# EAGLE design Adafruit Feather STM32F405 Express (EAGLE 9.5.2)
COMPANY: ADAFRUIT INDUSTRIES; DRAWN: KTOWN; REV: B
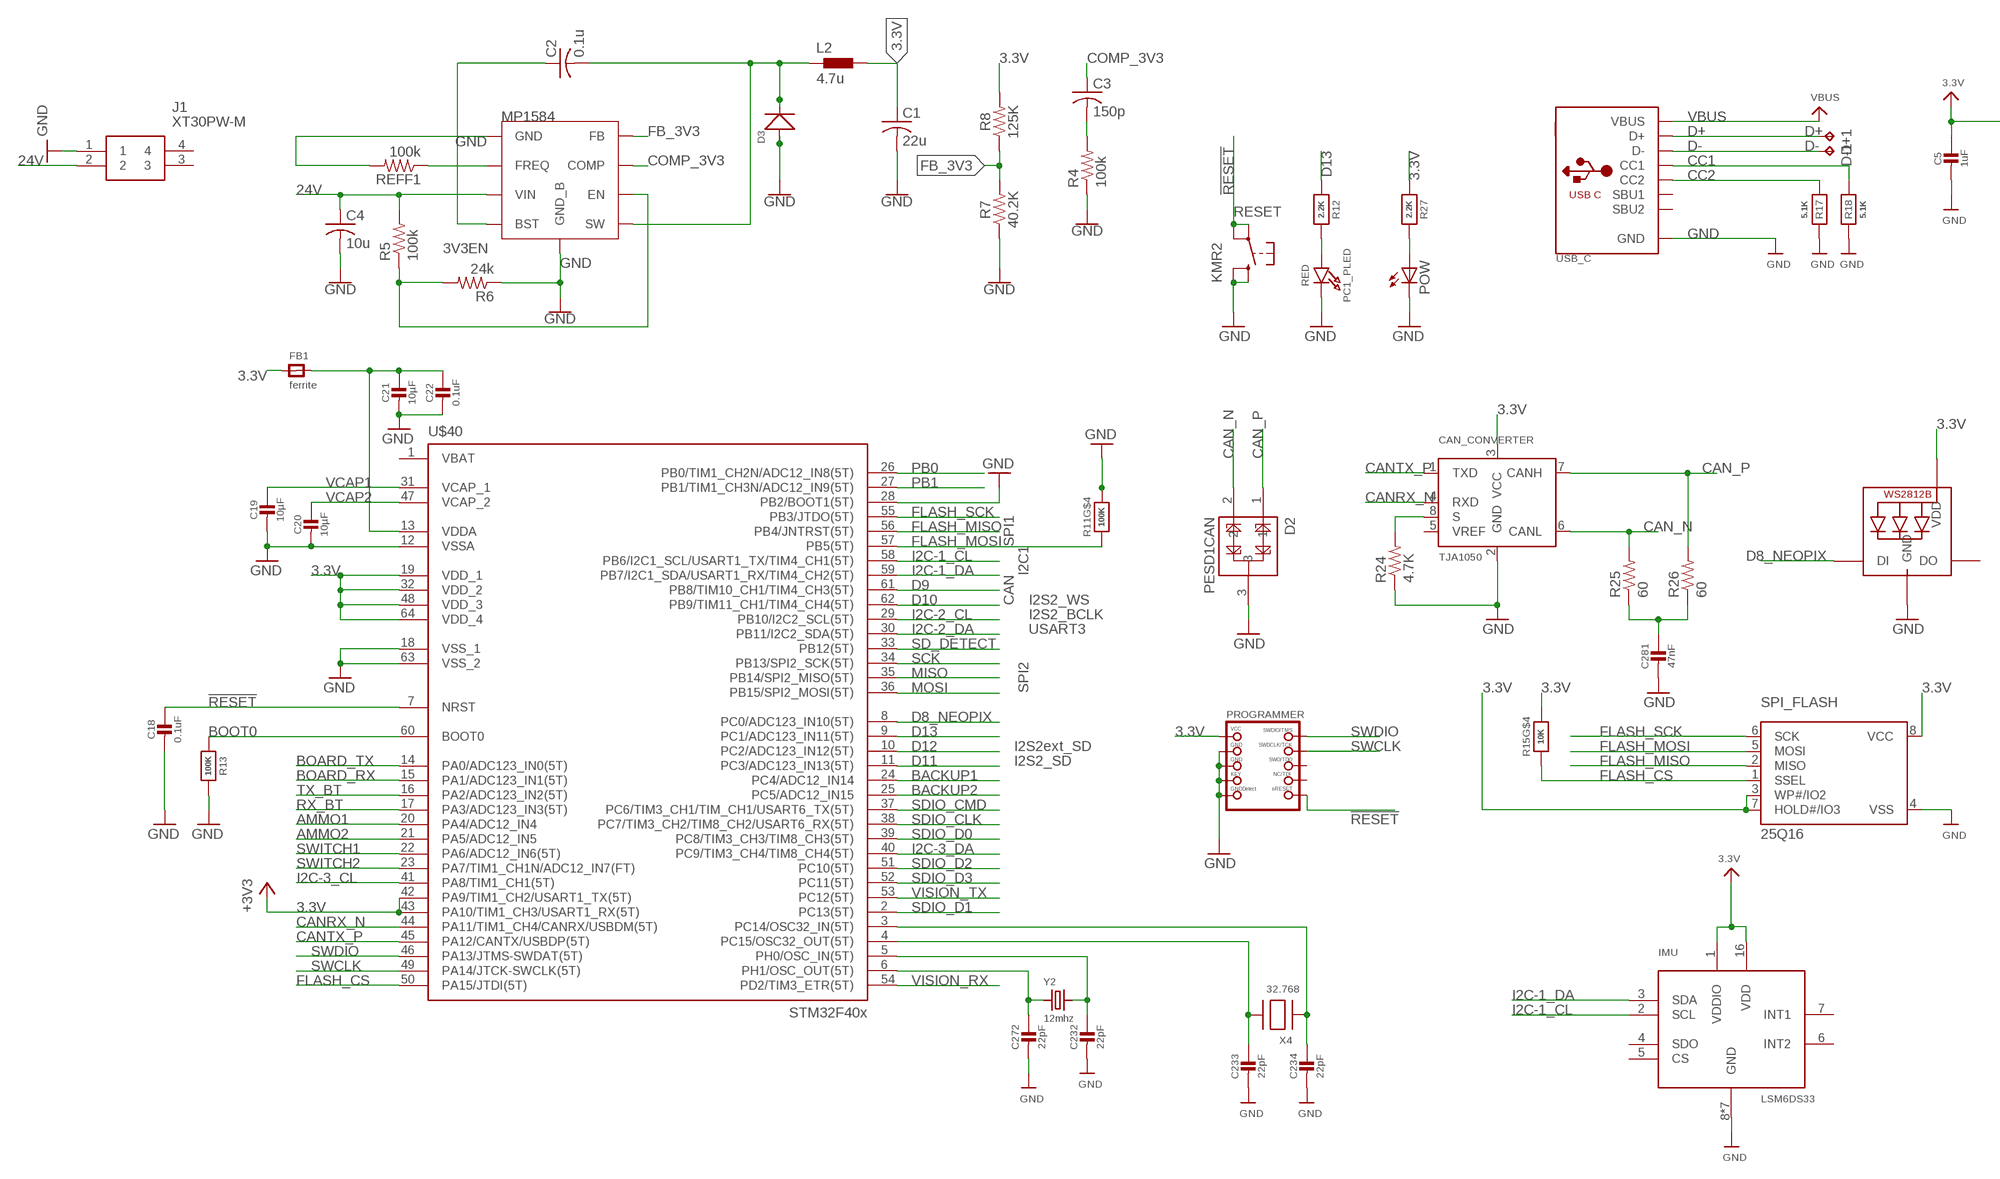
[diagram p0: schematic, sheet 1, part 1 of 2]
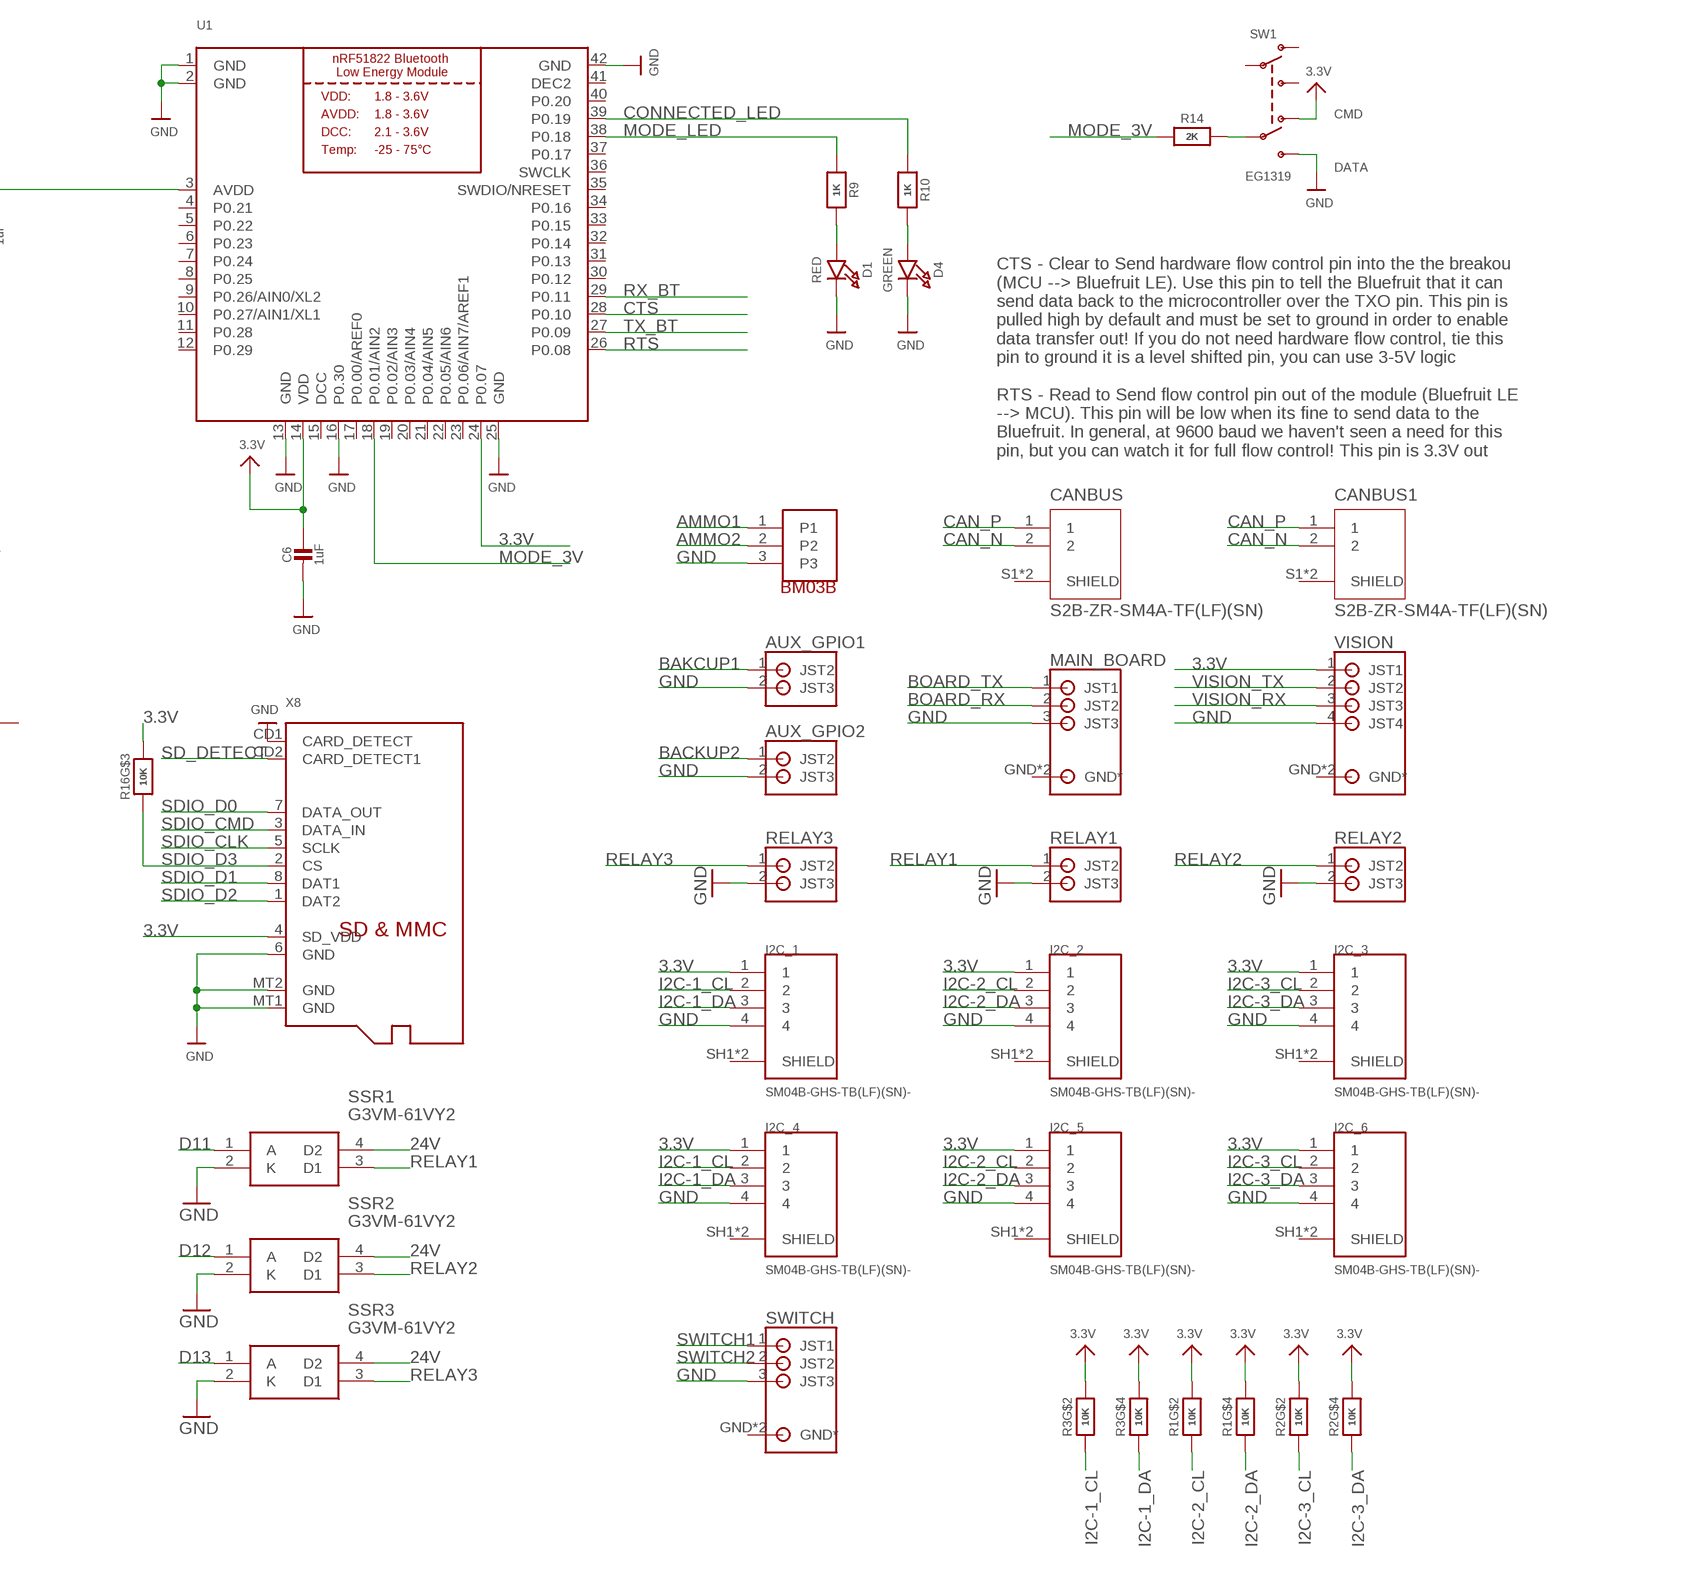
[diagram p1: schematic, sheet 1, part 2 of 2]

## Parts
AUX_GPIO1  S2B-PH-SM4_TB  [S2B-PH-SM4_TB]
AUX_GPIO2  S2B-PH-SM4_TB  [S2B-PH-SM4_TB]
C1  22u  C-USC1206  [C1206]
C2  0.1u  C-USC0603  [C0603]
C3  150p  C-USC0603  [C0603]
C4  10u  C-USC1206  [C1206]
C5  1uF  CAP_CERAMIC0805-NOOUTLINE  [0805-NO]
C6  1uF  CAP_CERAMIC0805-NOOUTLINE  [0805-NO]
C18  0.1uF  CAP_CERAMIC0603_NO  [0603-NO]
C19  10µF  CAP_CERAMIC0805-NOOUTLINE  [0805-NO]
C20  10µF  CAP_CERAMIC0805-NOOUTLINE  [0805-NO]
C21  10µF  CAP_CERAMIC0805-NOOUTLINE  [0805-NO]
C22  0.1uF  CAP_CERAMIC0603_NO  [0603-NO]
C23  22pF  CAP_4PACK1206  [RESPACK_4X0603]
C27  22pF  CAP_4PACK1206  [RESPACK_4X0603]
C28  47nF  CAP_4PACK1206  [RESPACK_4X0603]
CAN_CONVERTER  TJA1050  [SOT96-1]
CANBUS  S2B-ZR-SM4A-TF(LF)(SN)  [JST_S2B-ZR-SM4A-TF(LF)(SN)]
CANBUS1  S2B-ZR-SM4A-TF(LF)(SN)  [JST_S2B-ZR-SM4A-TF(LF)(SN)]
D1  RED  LED0805_NOOUTLINE  [CHIPLED_0805_NOOUTLINE]
D2  PESD1CAN  [SOT23-3]
D3  SMD-DIODE-SCHOTTKY-40V-3A(DO-214AB)  [DO-214AB]
D4  GREEN  LED0805_NOOUTLINE  [CHIPLED_0805_NOOUTLINE]
D+1  TPB1,27  [B1,27]
D-1  TPB1,27  [B1,27]
FB1  ferrite  FERRITE-0805NO  [0805-NO@1]
I2C_1  SM04B-GHS-TB(LF)(SN)-  [JST_SM04B-GHS-TB(LF)(SN)-]
I2C_2  SM04B-GHS-TB(LF)(SN)-  [JST_SM04B-GHS-TB(LF)(SN)-]
I2C_3  SM04B-GHS-TB(LF)(SN)-  [JST_SM04B-GHS-TB(LF)(SN)-]
I2C_4  SM04B-GHS-TB(LF)(SN)-  [JST_SM04B-GHS-TB(LF)(SN)-]
I2C_5  SM04B-GHS-TB(LF)(SN)-  [JST_SM04B-GHS-TB(LF)(SN)-]
I2C_6  SM04B-GHS-TB(LF)(SN)-  [JST_SM04B-GHS-TB(LF)(SN)-]
IMU  LSM6DS33  [LGA16_3X3MM]
J1  XT30PW-M  [XT30PWM]
L2  4.7u  MHCI0603-4R7M-R8  [MHCI0603-4R7M-R8]
LED2  WS2812B3535  [LED3535]
MAIN_BOARD  S3B-PH-SM4_TB  [S3B-PH-SM4_TB]
PC1_PLED  RED  LED0805_NOOUTLINE  [CHIPLED_0805_NOOUTLINE]
POW  LEDCHIPLED_0603  [CHIPLED_0603]
PROGRAMMER  JTAG-CORTEX  [2X05_1.27MM_SMT]
R1  10K  RESISTOR_4PACK  [RESPACK_4X0603]
R2  10K  RESISTOR_4PACK  [RESPACK_4X0603]
R3  10K  RESISTOR_4PACK  [RESPACK_4X0603]
R4  100k  R-US_R0603  [R0603]
R5  100k  R-US_R0603  [R0603]
R6  24k  R-US_R0603  [R0603]
R7  40.2K  220KOHM-0603-1/10W-1%  [0603]
R8  125K  RESISTOR0603  [0603]
R9  1K  RESISTOR0805_NOOUTLINE  [0805-NO]
R10  1K  RESISTOR0805_NOOUTLINE  [0805-NO]
R11  100K  RESISTOR_4PACK_NO  [RESPACK_4X0603_NO]
R12  2.2K  RESISTOR_0603_NOOUT  [0603-NO]
R13  100K  RESISTOR_0603_NOOUT  [0603-NO]
R14  2K  RESISTOR0805_NOOUTLINE  [0805-NO]
R15  10K  RESISTOR_4PACK_NO  [RESPACK_4X0603_NO]
R16  10K  RESISTOR_4PACK_NO  [RESPACK_4X0603_NO]
R17  5.1K  RESISTOR_0603_NOOUT  [0603-NO]
R18  5.1K  RESISTOR_0603_NOOUT  [0603-NO]
R24  4.7K  R-US_R0603  [R0603]
R25  60  R-US_R0603  [R0603]
R26  60  R-US_R0603  [R0603]
R27  2.2K  RESISTOR_0603_NOOUT  [0603-NO]
REFF1  100k  R-US_R0603  [R0603]
RELAY1  S2B-PH-SM4_TB  [S2B-PH-SM4_TB]
RELAY2  S2B-PH-SM4_TB  [S2B-PH-SM4_TB]
RELAY3  S2B-PH-SM4_TB  [S2B-PH-SM4_TB]
RESET  KMR2  SWITCH_TACT_SMT4.6X2.8  [BTN_KMR2_4.6X2.8]
SPI_FLASH  25Q16  SPIFLASH_8PIN  [SOIC8_150MIL]
SSR1  G3VM-61VY2  [SOP254P700X230-4N]
SSR2  G3VM-61VY2  [SOP254P700X230-4N]
SSR3  G3VM-61VY2  [SOP254P700X230-4N]
SW1  EG1319  SWITCH_DPDTEG1390  [EG1390]
SWITCH  S3B-PH-SM4_TB  [S3B-PH-SM4_TB]
U1  NRF51822_MODULE_MDBT40  [BLE_MODULE_RAYTAC_MDBT40]
U$6  BM03-GHS_TBT  [BM03-GHS-TBT]
U$10  MP1584_V2  [MP1584_V2]
U$40  STM32F405R  [TQFP64]
USB_C  USB_C  [USB_C_CUSB31-CFM2AX-01-X]
VISION  S4B-PH-SM4_TB  [S4B-PH-SM4_TB]
X4  32.768  XTAL-3.2X1.5  [XTAL3215]
X8  MICROSD  [MICROSD]
Y2  12mhz  CRYSTAL2.5X2.0  [CRYSTAL_2.5X2]

## Nets
3.3V: C1.1 C5.1 C6.1 CAN_CONVERTER.3(VCC) FB1.1 I2C_1.1 I2C_2.1 I2C_3.1 I2C_4.1 I2C_5.1 I2C_6.1 IMU.1(VDDIO) IMU.16(VDD) L2.P$2 LED2.2(VDD) PROGRAMMER.1(VCC) R1.2 R1.4 R2.2 R2.4 R3.2 R3.4 R8.2 R15.5 R16.6 R27.1 SPI_FLASH.3(WP#/IO2) SPI_FLASH.7(HOLD#/IO3) SPI_FLASH.8(VCC) SW1.O2 U1.3(AVDD) U1.14(VDD) U1.24(P0.07) U$40.19(VDD_1) U$40.32(VDD_2) U$40.42(PA9/TIM1_CH2/USART1_TX(5T)) U$40.43(PA10/TIM1_CH3/USART1_RX(5T)) U$40.48(VDD_3) U$40.64(VDD_4) VISION.1(JST1) X8.4(SD_VDD) ; supply symbol labelled +3V3
3V3EN: R5.1 R6.2 U$10.EN
24V [power]: C4.1 J1.2 R5.2 SSR1.4(D2) SSR2.4(D2) SSR3.4(D2) U$10.VIN
!RESET: C18.1 PROGRAMMER.10(NRESET) RESET.A'(P1) RESET.A(P) U$40.7(NRST)
AMMO1: U$6.1 U$40.20(PA4/ADC12_IN4)
AMMO2: U$6.2 U$40.21(PA5/ADC12_IN5)
BACKUP1: U$40.24(PC4/ADC12_IN14)
BACKUP2: AUX_GPIO2.1(JST2) U$40.25(PC5/ADC12_IN15)
BAKCUP1: AUX_GPIO1.1(JST2)
BOARD_RX: MAIN_BOARD.2(JST2) U$40.15(PA1/ADC123_IN1(5T))
BOARD_TX: MAIN_BOARD.1(JST1) U$40.14(PA0/ADC123_IN0(5T))
BOOT0: R13.1 U$40.60(BOOT0)
BST1: C2.1 U$10.BST
CAN_N: CAN_CONVERTER.6(CANL) CANBUS1.2 CANBUS.2 D2.2 R25.2
CAN_P: CAN_CONVERTER.7(CANH) CANBUS1.1 CANBUS.1 D2.1 R26.2
CANRX_N: CAN_CONVERTER.4(RXD) U$40.44(PA11/TIM1_CH4/CANRX/USBDM(5T))
CANTX_P: CAN_CONVERTER.1(TXD) U$40.45(PA12/CANTX/USBDP(5T))
CC1: R18.2 USB_C.A5(CC1)
CC2: R17.2 USB_C.B5(CC2)
COMP_3V3: C3.1 U$10.COMP
CONNECTED_LED: R10.1 U1.39(P0.19)
CTS: U1.28(P0.10)
D8_NEOPIX: LED2.1(DI) U$40.8(PC0/ADC123_IN10(5T))
D9: U$40.61(PB8/TIM10_CH1/TIM4_CH3(5T))
D10: U$40.62(PB9/TIM11_CH1/TIM4_CH4(5T))
D11: SSR1.1(A) U$40.11(PC3/ADC123_IN13(5T))
D12: SSR2.1(A) U$40.10(PC2/ADC123_IN12(5T))
D13: R12.1 SSR3.1(A) U$40.9(PC1/ADC123_IN11(5T))
D+: D+1.TP USB_C.A6(D+) USB_C.B6(D+)
D-: D-1.TP USB_C.A7(D-) USB_C.B7(D-)
FB_3V3: R7.2 R8.1 U$10.FB
FLASH_CS: R15.4 SPI_FLASH.1(SSEL) U$40.50(PA15/JTDI(5T))
FLASH_MISO: SPI_FLASH.2(MISO) U$40.56(PB4/JNTRST(5T))
FLASH_MOSI: R11.4 SPI_FLASH.5(MOSI) U$40.57(PB5(5T))
FLASH_SCK: SPI_FLASH.6(SCK) U$40.55(PB3/JTDO(5T))
FREQ1: REFF1.1 U$10.FREQ
GND [gnd]: AUX_GPIO1.2(JST3) AUX_GPIO2.2(JST3) C1.2 C4.2 C5.2 C6.2 C18.2 C19.2 C20.2 C21.2 C22.2 C23.5 C23.6 C23.7 C27.7 C28.8 CAN_CONVERTER.2(GND) D1.C D2.3 D3.1(+) D4.C I2C_1.4 I2C_2.4 I2C_3.4 I2C_4.4 I2C_5.4 I2C_6.4 IMU.8(GND) IMU.9(GND) IMU.10(GND) IMU.11(GND) IMU.12(GND) IMU.13(GND) IMU.15(GND) J1.1 LED2.4(GND) MAIN_BOARD.3(JST3) PC1_PLED.C POW.C PROGRAMMER.3(GND) PROGRAMMER.5(GND) PROGRAMMER.7(KEY) PROGRAMMER.9(GNDDETECT) R4.1 R6.1 R7.1 R11.5 R13.2 R17.1 R18.1 R24.1 REFF1.2 RELAY1.2(JST3) RELAY2.2(JST3) RELAY3.2(JST3) RESET.B'(S1) RESET.B(S) SPI_FLASH.4(VSS) SSR1.2(K) SSR2.2(K) SSR3.2(K) SW1.S2 SWITCH.3(JST3) U1.1(GND) U1.2(GND) U1.13(GND) U1.16(P0.30) U1.25(GND) U1.42(GND) U$6.3 U$10.GND U$10.GND_B U$40.12(VSSA) U$40.18(VSS_1) U$40.28(PB2/BOOT1(5T)) U$40.63(VSS_2) USB_C.A1B12(GND) USB_C.B1A12(GND) VISION.4(JST4) X8.6(GND) X8.CD1(CARD_DETECT) X8.MT1(GND) X8.MT2(GND)
I2C-1_CL: I2C_1.2 I2C_4.2 IMU.2(SCL) R3.7 U$40.58(PB6/I2C1_SCL/USART1_TX/TIM4_CH1(5T))
I2C-1_DA: I2C_1.3 I2C_4.3 IMU.3(SDA) R3.5 U$40.59(PB7/I2C1_SDA/USART1_RX/TIM4_CH2(5T))
I2C-2_CL: I2C_2.2 I2C_5.2 R1.7 U$40.29(PB10/I2C2_SCL(5T))
I2C-2_DA: I2C_2.3 I2C_5.3 R1.5 U$40.30(PB11/I2C2_SDA(5T))
I2C-3_CL: I2C_3.2 I2C_6.2 R2.7 U$40.41(PA8/TIM1_CH1(5T))
I2C-3_DA: I2C_3.3 I2C_6.3 R2.5 U$40.40(PC9/TIM3_CH4/TIM8_CH4(5T))
MISO: U$40.35(PB14/SPI2_MISO(5T))
MODE_3V: R14.1 U1.18(P0.01/AIN2)
MODE_LED: R9.1 U1.38(P0.18)
MOSI: U$40.36(PB15/SPI2_MOSI(5T))
N$3: C3.2 R4.2
N$4: R14.2 SW1.P2
N$5: D1.A R9.2
N$6: D4.A R10.2
N$9: C23.4 U$40.3(PC14/OSC32_IN(5T)) X4.P$1
N$10: C23.3 U$40.4(PC15/OSC32_OUT(5T)) X4.P$2
N$11: C23.2 U$40.5(PH0/OSC_IN(5T)) Y2.3
N$12: C27.2 U$40.6(PH1/OSC_OUT(5T)) Y2.1
N$13: PC1_PLED.A R12.2
N$20: C21.1 C22.1 FB1.2 U$40.13(VDDA)
N$21: CAN_CONVERTER.8(S) R24.2
N$22: C28.1 R25.1 R26.1
N$23: POW.A R27.2
PB0: U$40.26(PB0/TIM1_CH2N/ADC12_IN8(5T))
PB1: U$40.27(PB1/TIM1_CH3N/ADC12_IN9(5T))
RELAY1: RELAY1.1(JST2) SSR1.3(D1)
RELAY2: RELAY2.1(JST2) SSR2.3(D1)
RELAY3: RELAY3.1(JST2) SSR3.3(D1)
RTS: U1.26(P0.08)
RX_BT: U1.29(P0.11) U$40.17(PA3/ADC123_IN3(5T))
SCK: U$40.34(PB13/SPI2_SCK(5T))
SD_DETECT: U$40.33(PB12(5T)) X8.CD2(CARD_DETECT1)
SDIO_CLK: U$40.38(PC7/TIM3_CH2/TIM8_CH2/USART6_RX(5T)) X8.5(SCLK)
SDIO_CMD: U$40.37(PC6/TIM3_CH1/TIM_CH1/USART6_TX(5T)) X8.3(DATA_IN)
SDIO_D0: U$40.39(PC8/TIM3_CH3/TIM8_CH3(5T)) X8.7(DATA_OUT)
SDIO_D1: U$40.2(PC13(5T)) X8.8(DAT1)
SDIO_D2: U$40.51(PC10(5T)) X8.1(DAT2)
SDIO_D3: R16.3 U$40.52(PC11(5T)) X8.2(CS)
SW1: C2.2 D3.2(-) L2.P$1 U$10.SW
SWCLK: PROGRAMMER.4(SWDCLK) U$40.49(PA14/JTCK-SWCLK(5T))
SWDIO: PROGRAMMER.2(SWDIO) U$40.46(PA13/JTMS-SWDAT(5T))
SWITCH1: SWITCH.1(JST1) U$40.22(PA6/ADC12_IN6(5T))
SWITCH2: SWITCH.2(JST2) U$40.23(PA7/TIM1_CH1N/ADC12_IN7(FT))
TX_BT: U1.27(P0.09) U$40.16(PA2/ADC123_IN2(5T))
VBUS [power]: USB_C.A4B9(VBUS) USB_C.B4A9(VBUS)
VCAP1: C19.1 U$40.31(VCAP_1)
VCAP2: C20.1 U$40.47(VCAP_2)
VISION_RX: U$40.54(PD2/TIM3_ETR(5T)) VISION.3(JST3)
VISION_TX: U$40.53(PC12(5T)) VISION.2(JST2)
Unconnected: C23.1 C23.8 C27.1 C27.3 C27.4 C27.5 C27.6 C27.8 C28.2 C28.3 C28.4 C28.5 C28.6 C28.7 CAN_CONVERTER.5(VREF) CANBUS1.S1(SHIELD) CANBUS1.S2(SHIELD) CANBUS.S1(SHIELD) CANBUS.S2(SHIELD) IMU.4(SDO) IMU.5(CS) IMU.6(INT2) IMU.7(INT1) J1.3 J1.4 LED2.3(DO) MAIN_BOARD.GND2(GND*) MAIN_BOARD.GND(GND*) PROGRAMMER.6(SWO) PROGRAMMER.8(TDI) R1.1 R1.3 R1.6 R1.8 R2.1 R2.3 R2.6 R2.8 R3.1 R3.3 R3.6 R3.8 R11.1 R11.2 R11.3 R11.6 R11.7 R11.8 R15.1 R15.2 R15.3 R15.6 R15.7 R15.8 R16.1 R16.2 R16.4 R16.5 R16.7 R16.8 SW1.O1 SW1.P1 SW1.S1 SWITCH.GND2(GND*) SWITCH.GND(GND*) U1.4(P0.21) U1.5(P0.22) U1.6(P0.23) U1.7(P0.24) U1.8(P0.25) U1.9(P0.26/AIN0/XL2) U1.10(P0.27/AIN1/XL1) U1.11(P0.28) U1.12(P0.29) U1.17(P0.00/AREF0) U1.19(P0.02/AIN3) U1.20(P0.03/AIN4) U1.21(P0.04/AIN5) U1.22(P0.05/AIN6) U1.23(P0.06/AIN7/AREF1) U1.30(P0.12) U1.31(P0.13) U1.32(P0.14) U1.33(P0.15) U1.34(P0.16) U1.35(SWDIO/NRESET) U1.36(SWCLK) U1.37(P0.17) U1.40(P0.20) U$40.1(VBAT) USB_C.A8(SBU1) USB_C.B8(SBU2) VISION.GND2(GND*) VISION.GND(GND*)

## Notes on the sheet
- CMD
- DATA
- CTS - Clear to Send hardware flow control pin into the the breakou 
  (MCU --> Bluefruit LE). Use this pin to tell the Bluefruit that it can 
  send data back to the microcontroller over the TXO pin. This pin is 
  pulled high by default and must be set to ground in order to enable 
  data transfer out! If you do not need hardware flow control, tie this 
  pin to ground it is a level shifted pin, you can use 3-5V logic
  
  RTS - Read to Send flow control pin out of the module (Bluefruit LE 
  --> MCU). This pin will be low when its fine to send data to the 
  Bluefruit. In general, at 9600 baud we haven't seen a need for this 
  pin, but you can watch it for full flow control! This pin is 3.3V out
- SPI1
- I2C1
- CAN | I2S2_WS
- I2S2_BCLK
- USART3
- SPI2
- I2S2ext_SD
- I2S2_SD

## Power pins joined to a net without a drawn wire
DCC: U1.15(DCC)
DEC2: U1.41(DEC2)
SHIELD: I2C_1.SH1(SHIELD) I2C_1.SH2(SHIELD) I2C_2.SH1(SHIELD) I2C_2.SH2(SHIELD) I2C_3.SH1(SHIELD) I2C_3.SH2(SHIELD) I2C_4.SH1(SHIELD) I2C_4.SH2(SHIELD) I2C_5.SH1(SHIELD) I2C_5.SH2(SHIELD) I2C_6.SH1(SHIELD) I2C_6.SH2(SHIELD)

## Library data of the parts
AUX_GPIO1 AUX_GPIO2 RELAY1-RELAY3 = KevinMade:S2B-PH-SM4_TB
C1-C4 = adafruit:C-US: CAPACITOR, American symbol
C5 C6 C18-C22 = microbuilder:CAP_CERAMIC: Ceramic Capacitors For new designs, use the packages preceded by an '_' character since they are more reliable: The following footprints should be used on most boards: _0402 - Standard footprint for regular board layouts _0603 - Standard footprint for regular board layouts _0805 - Standard footprint for regular board layouts _1206 - Standard footprint for regular board layouts For extremely tight-pitch boards where space is at a premium, the following 'micro-pitch' footprints can be used (smaller pads, no silkscreen outline, etc.): _0402MP - Micro-pitch footprint for very dense/compact boards _0603MP - Micro-pitch footprint for very dense/compact boards _0805MP - Micro-pitch footprint for very dense/compact boards _1206MP - Micro-pitch footprint for very dense/compact boards
C23 C27 C28 = microbuilder:CAP_4PACK
CAN_CONVERTER = TJA1050:TJA1050: High speed CAN transceiver The TJA1050 is the interface between the Controller Area Network (CAN) protocol controller and the physical bus. The device provides differential transmit capability to the bus and differential receive capability to the CAN controller. The TJA1050 is the third Philips high-speed CAN transceiver after the PCA82C250 and the PCA82C251. The most important differences are: Much lower electromagnetic emission due to optimal matching of the output signals CANH and CANL Improved behaviour in case of an unpowered node No standby mode. This makes the TJA1050 eminently suitable for use in nodes that are in a power-down situation in partially powered networks. AAL Eindhoven MK; AVAILABILITY: Unavailable; DESCRIPTION: 1/1 Transceiver Half CANbus 8-SO; MF: NXP USA; MP: TJA1050; PACKAGE: SOIC-8 NXP USA; PRICE: None
CANBUS CANBUS1 = S2B-ZR-SM4A-TF_LF__SN_:S2B-ZR-SM4A-TF(LF)(SN): ZH Series 2 Position 1.5 mm Pitch Surface Mount Side Entry Shrouded Header; AVAILABILITY: Unavailable; DESCRIPTION: Connector Header Surface Mount, Right Angle 2 position 0.059 _1.50mm_; MF: JST Sales; MP: S2B-ZR-SM4A-TF_LF__SN_; PACKAGE: None; PRICE: None
D1 D4 PC1_PLED = microbuilder:LED: LED
D2 = PESD1CAN:PESD1CAN: PESD1CAN is used to protect two automotive CAN bus lines from ESD.; AVAILABILITY: Unavailable; DESCRIPTION: 50V Clamp 3A _8/20µs_ Ipp Tvs Diode Surface Mount SC-70; MF: NXP Semiconductors; MP: PESD1CAN; PACKAGE: SC-70 NXP Semiconductors; PRICE: None
D3 = SMD-DIODE-SCHOTTKY-40V-3A_DO-214AB_:SMD-DIODE-SCHOTTKY-40V-3A(DO-214AB): 304020018; AVAILABILITY: Unavailable; DESCRIPTION: Rectifier, Schottky; DO-214AB; 3.0A IF; 0.75V; 40V; 100A IFRM; 10000V/us; 1000pF; MF: Vishay; MP: SS34-E3/57T; PACKAGE: DO-214 Vishay; PRICE: None
D+1 D-1 = testpad:TP: Test pad
FB1 = microbuilder:FERRITE: Ferrite Bead 0603 MMZ1608B121C - 120 Ohm @ 100MHz, 600mA, 0.15 Ohm DC Resistance - Digikey: 445-2164-1-ND BK1608HW121-T - 120 Ohm, 600mA Ferrite Chip - Digikey: 587-1876-2-ND 0805 HZ0805B272R-10 - 2.7K Ohm @ 100MHz, 200mA, 0.8 Ohm DC Resistance - Digikey: 240-2504-1-ND (see also Murata BLM21BD272SN1L) MMZ2012Y152B - 1.5K Ohm @ 100MHz, 500mA, 0.4 Ohm DC Resistance - Digikey: 445-1560-1-ND - Mainly for high frequency (80-400MHz) MMZ2012R102A - 1K Ohm @ 100MHz, 500mA, 0.3 Ohm DC Resistance - Digikey: 445-1555-2-ND - More general purpose (10-200MHz)
I2C_1-I2C_6 = SM04B-GHS-TB_LF__SN_-:SM04B-GHS-TB(LF)(SN)-: Conn Header Gh Side 4pos 1.25mm; AVAILABILITY: Unavailable; DESCRIPTION: Connector Header Surface Mount, Right Angle 4 position 0.049 _1.25mm_; MF: JST Sales; MP: SM04B-GHS-TB_LF__SN_-; PACKAGE: None; PRICE: None
IMU = adafruit_sensor:LSM6DS33
J1 = SamacSys_Parts:XT30PW-M: 30A Low Temperature Rise Fire Retardant Plug Source: Datasheet <https://www.tme.eu/sl/Document/ce4077e36b79046da520ca73227e15de/XT30PW SPEC.pdf>; DESCRIPTION: 30A Low Temperature Rise Fire Retardant Plug; HEIGHT: 5mm; MANUFACTURER_NAME: Amass; MANUFACTURER_PART_NUMBER: XT30PW-M
L2 = NewKevinMade:MHCI0603-4R7M-R8
LED2 = microbuilder:WS2812B
MAIN_BOARD SWITCH = KevinMade:S3B-PH-SM4_TB
POW = adafruit:LED: LED
PROGRAMMER = microbuilder:JTAG-CORTEX: Serial Wire (SW-DP) Connector Standard 0.05" 10-pin connector is for use with the Cortex M and Cortex A SWD (serial wire debugger) interface (SW-DP) Connectors 2x05_1.27MM_SMT - Inexpensive surface-mount header with bare pins, compatible with standard 10-pin SWD cables (4UCON: 16846) 2x05_1.27MM_BOX_NOPOSTS - Polarised surface-mount box (4UCON with caps: 19735, without caps: 15117 2x05_1.27MM_BOX_POSTS - Polarised surface-mount box with mounting holes (4UCON: 20317) Pinout: http://infocenter.arm.com/help/topic/com.arm.doc.faqs/attached/13634/cortex_debug_connectors.pdf http://www.keil.com/peripherals/coresight/connectors.asp
R1-R3 R11 R15 R16 = microbuilder:RESISTOR_4PACK: Resistor Packs (4 resistors) 4 x 0603 10K 1/16W - Digikey: YC164J-10KCT-ND
R4-R6 R24-R26 REFF1 = adafruit:R-US_: RESISTOR, American symbol
R7 = SparkFun-Resistors:220KOHM: 220kΩ resistor A resistor is a passive two-terminal electrical component that implements electrical resistance as a circuit element. Resistors act to reduce current flow, and, at the same time, act to lower voltage levels within circuits. - Wikipedia; PROD_ID: RES-08969; VALUE: 220k
R8 = SparkFun-Resistors:RESISTOR: Generic Resistor Package
R9 R10 R12-R14 R17 R18 R27 = microbuilder:RESISTOR: Resistors For new designs, use the packages preceded by an '_' character since they are more reliable: The following footprints should be used on most boards: _0402 - Standard footprint for regular board layouts _0603 - Standard footprint for regular board layouts _0805 - Standard footprint for regular board layouts _1206 - Standard footprint for regular board layouts For extremely tight-pitch boards where space is at a premium, the following 'micro-pitch' footprints can be used (smaller pads, no silkscreen outline, etc.): _0402MP - Micro-pitch footprint for very dense/compact boards _0603MP - Micro-pitch footprint for very dense/compact boards _0805MP - Micro-pitch footprint for very dense/compact boards _1206MP - Micro-pitch footprint for very dense/compact boards
RESET = microbuilder:SWITCH_TACT_SMT: SMT Tact Switches 6x6mm - Digikey: P12940SCT-ND KMR2 (4.6x2.8mm) - Digikey: 401-1426-1-ND EVQ-PQHB55 - Light Touch, 160GF (4.5x4.5mm) - Digikey: P8090SCT-ND KMT0 - KMT021 NGJ LHS (etc.) IP68/Waterproof - Digikey: CKN10289CT-ND
SPI_FLASH = microbuilder:SPIFLASH_8PIN: SOIC8 SPI Flash Be careful with the size since SOIC8 flash comes in several 'widths' SOIC8 150 mil M25P16 - 16Mbit (2Mbit x 8) Serial Flash (75MHz SPI Bus), Supply: 2.7-3.6V Digikey: SOIC8 - M25P16-VMN6P-ND SOIC8 208 mil W25Q16BVSSIG - 16Mbit (2Mbit x 8) Serial Flash (104MHz SPI Bus), Supply: 2.7-3.6V Digikey: SOIC8 - W25Q16BVSSIG-ND
SSR1-SSR3 = SamacSys_Parts:G3VM-61VY2: Solid State Relays - PCB Mount Mos Fet Relay, SMT 60V, 1 form A,SOP4 Source: Datasheet <https://componentsearchengine.com/Datasheets/1/G3VM-61VY2.pdf>; DESCRIPTION: Solid State Relays - PCB Mount Mos Fet Relay, SMT 60V, 1 form A,SOP4; HEIGHT: 2.3mm; MANUFACTURER_NAME: Omron Electronics; MANUFACTURER_PART_NUMBER: G3VM-61VY2; MOUSER_PART_NUMBER: 653-G3VM61VY2; MOUSER_PRICE-STOCK: https://www.mouser.com/Search/Refine.aspx?Keyword=653-G3VM61VY2
SW1 = microbuilder:SWITCH_DPDT: Switch - DPDT A DPDT Switch acts like an SPDT switch, but has a pair of switches instead of just one. Vertical - 0.3A @ 6V SMT - Digikey: JS202011SCQN
U1 = microbuilder:NRF51822_MODULE_MDBT40: nRF51822 Bluetooth Low Energy Module
U$6 = SamacSys_Parts:BM03-GHS_TBT
U$10 = mp1584S:MP1584_V2
U$40 = adafruit_micro:STM32F405R: STM32F405 64 pin LQFP reviewed: YES tested: YES
USB_C = microbuilder:USB_C: USB Type-C USB 2.0 Connector
VISION = KevinMade:S4B-PH-SM4_TB
X4 = adafruit2:XTAL: Low cost SMT crystals, no capacitors included http://www.ladyada.net/library/eagle
X8 = microbuilder:MICROSD: MicroSD/Transflash Card Holder with SPI pinout 3M: 2908-05WB-MG 4UConnector: 19656 Footprint courtesy: Adafruit Industries
Y2 = microbuilder:CRYSTAL: Crystals HC49UP - Surface Mount Crystal 4.0MHz 18pF +/-30ppm Surface Mount Crystal [Digikey: 535-9857-1-ND] 12.0 MHz Surface Mount Crystal [Digikey: 535-9869-6-ND] 25.0 MHz Surface Mount Crystal [Digikey: 535-9078-1-ND] 2.5 x 2.0mm - MEMs SMT Crystal 16.0 MHz 10pF 20ppm 2.5 x 2.0mm Crystal [Digikey -40-85°C: 535-10923-1-ND] 3.2 x 2.5mm - MEMs SMT Crystal 12.0 MHz 8pF 15ppm 3.2 x 2.5mm Crystal [Digikey: -10-70°C: 644-1047-1-ND -40-125°C: 644-1128-1-ND] 40~85°C cheaper: 644-1173-6-ND 16.0 MHz 8pF 15ppm 3.2 x 2.5mm Crystal [Digikey: -10-70°C: 644-1049-1-ND -40-125°C: 644-1129-2-ND]-40~85°C cheaper: 644-1175-6-ND 16.0 MHz 10pF 10ppm 3.2 x 2.5mm Crystal [Digikey: 644-1100-1-ND] 27.12 MHz 18pF 30ppm 3.2 x 2.5mm Crystal [Digikey: 887-1424-1-ND] 27.12MHz 10pF 10ppm 3.2 x 2.5mm Crystal [Digikey: 887-1329-1-ND] 4.9 x 1.8mm - MEMs SMT Crystal 32.768 KHz 12.5pF 20ppm 4.9 x 1.8mm Crystal [Digikey: SE2415CT-ND] 8.0 x 3.8mm - Surface Mount Crystal 32.768kHz 12.5pF 20ppm -40°C-85°C [Digikey: 535-9166-2-ND] Cylinder 32.768KHz Cylinder Crystal (2x6mm body) [Ex. Digikey: 300-8341-2-ND]

## Net classes
1 power: width 0.305 mm
2 gnd: width 0.254 mm
3 can: width 0.203 mm
4 canx: width 0.203 mm

## Board
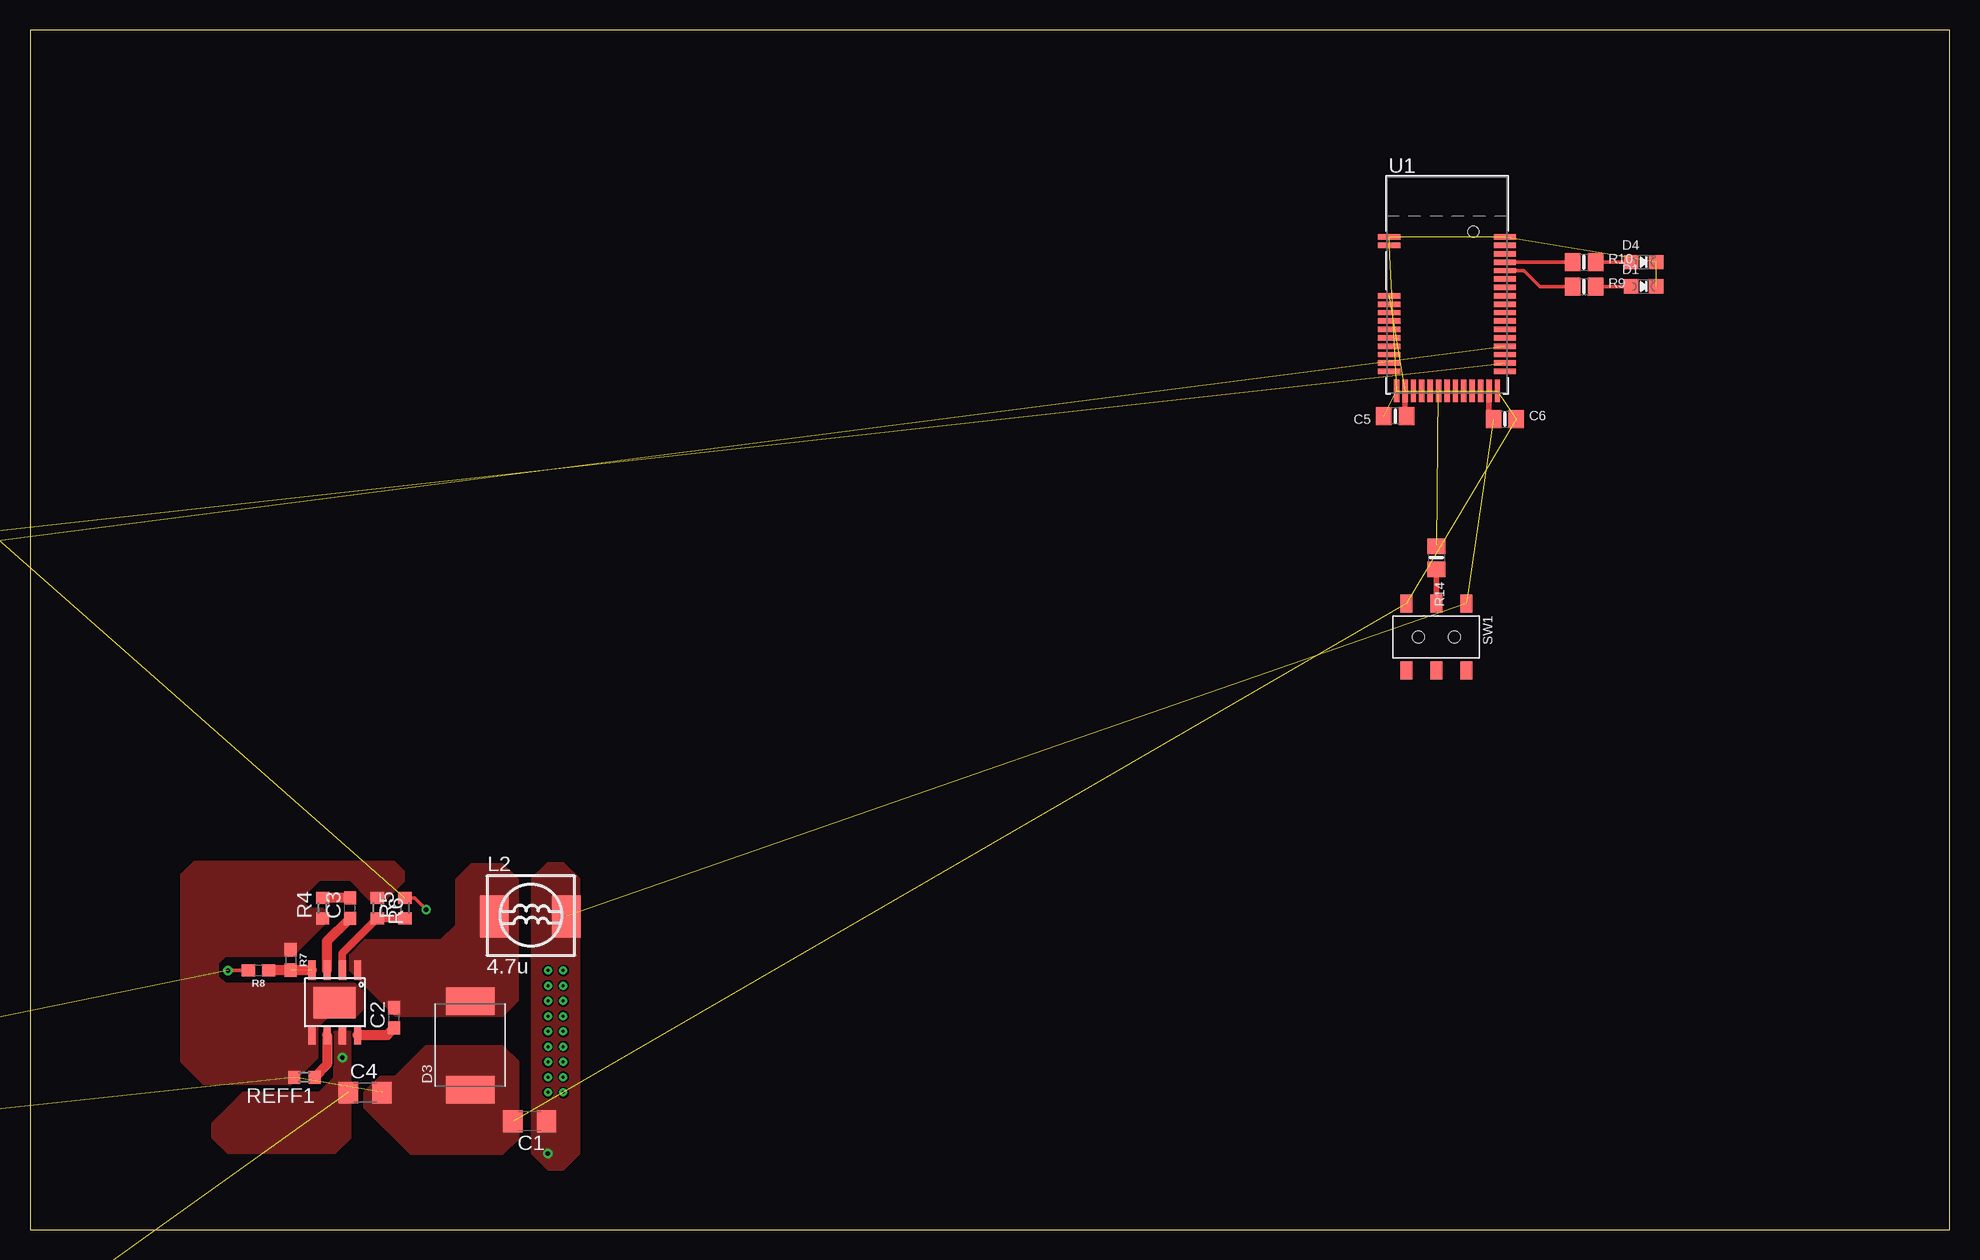
[diagram p2: board, top side]
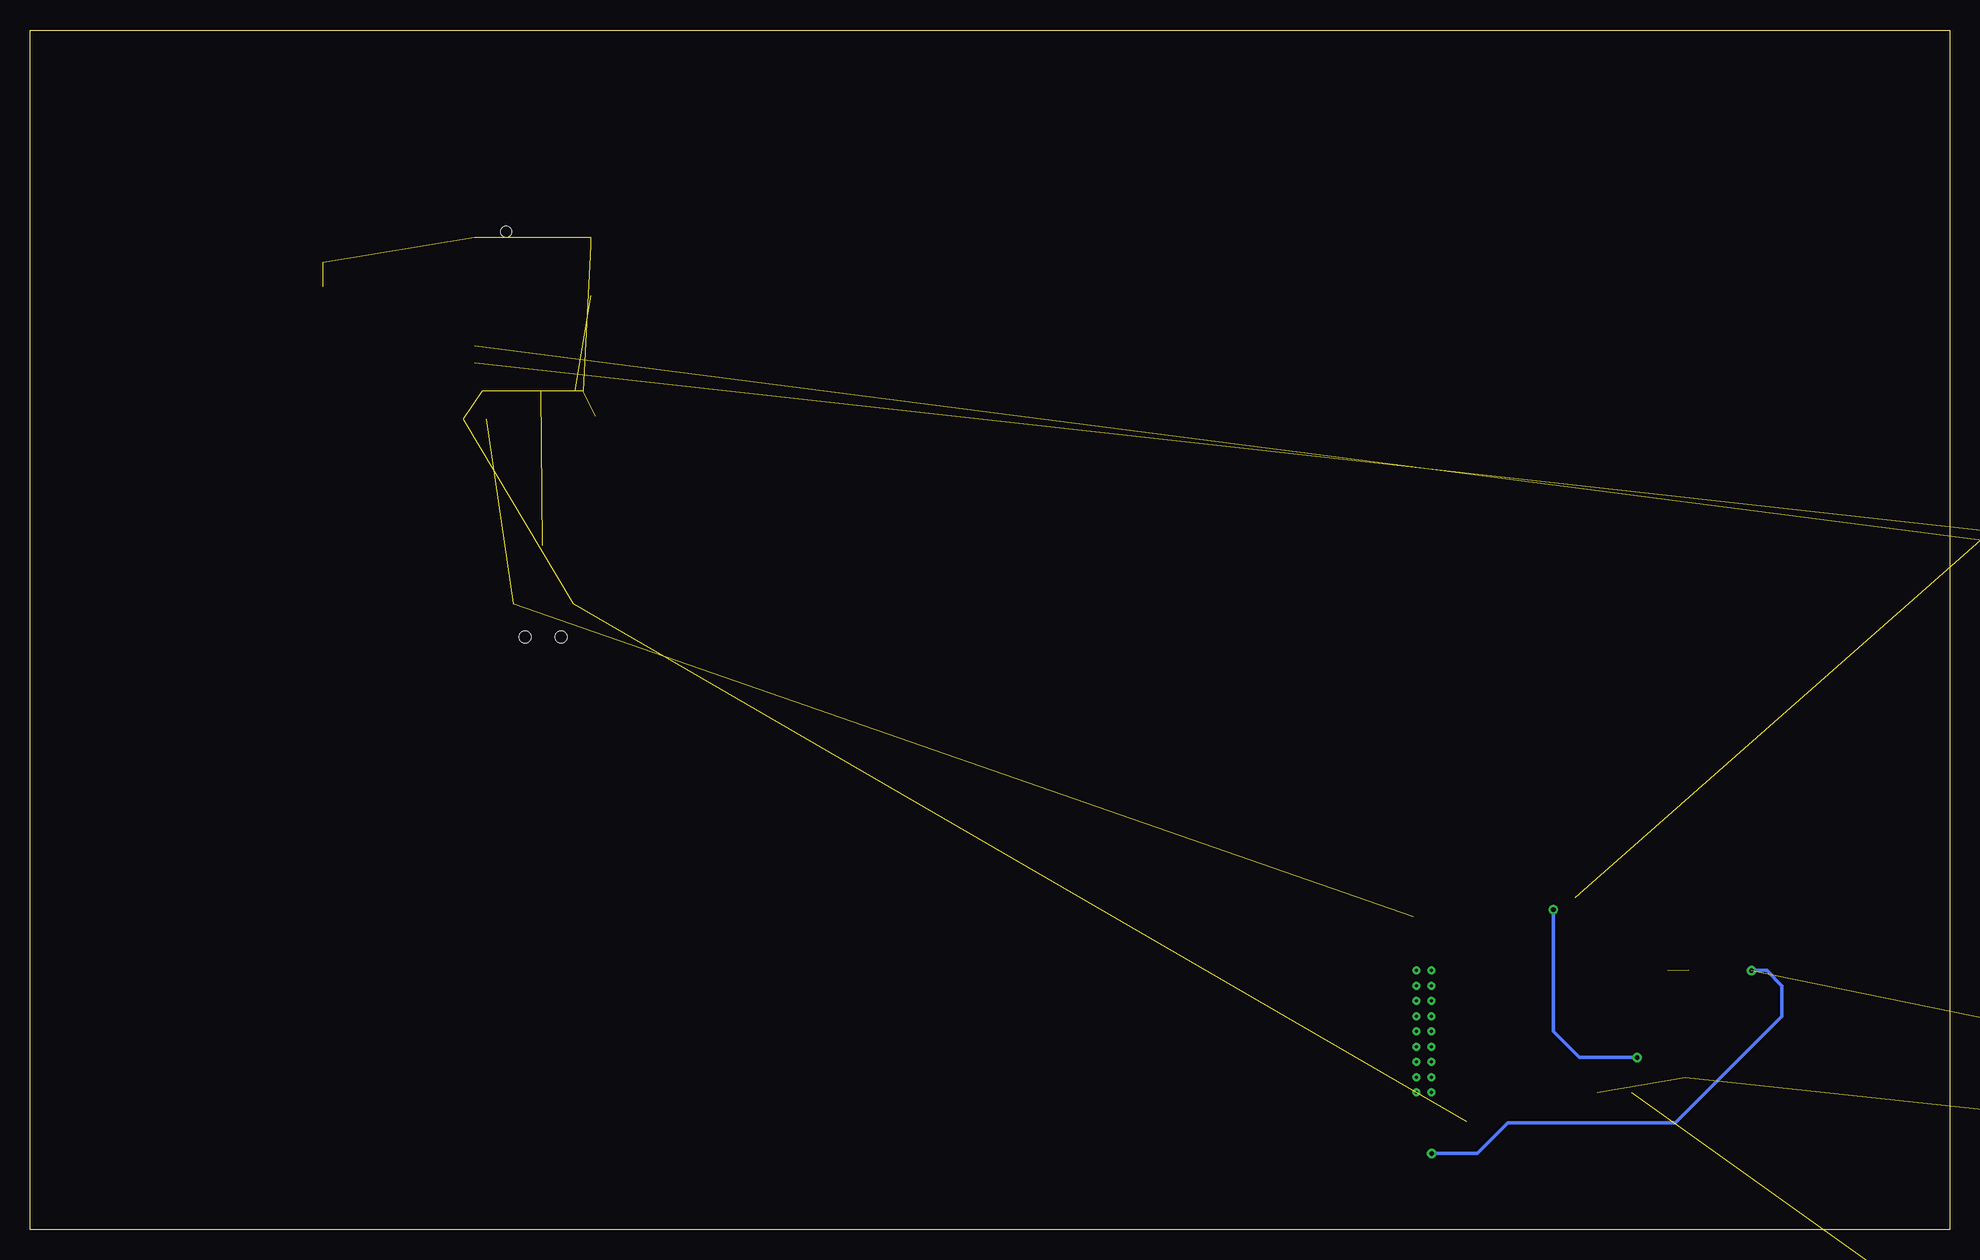
[diagram p3: board, bottom side, seen from below]

Size 160 x 100 mm. Coordinates in mm from the lower left corner, seen from the top.
Outline: 0,0 160,0 160,100 0,100 0,0
Copper layers (1*16): Top 0.035mm / dielectric 1.5mm / Bottom 0.035mm
Design rules "default": minimum track width 6mil, minimum drill 0.35mm, track to track 6mil, track to pad 6mil, pad to pad 6mil, via to via 6mil, smd to smd 6mil, copper to edge 40mil, drill to drill 6mil, minimum pad ring 10mil, minimum via ring 8mil, stop-mask expansion 4mil, vias tented up to drill 0mil, thermal gap 10mil

### Footprints (pad centres in the part's own frame; a part is rotated, then mirrored left to right if it is on the bottom)
S2B-PH-SM4_TB = smd 1 x 2.6: 1 3.81,8.28; 2 5.81,8.28 | smd 1 x 3: GND 0.826,2.48; GND2 8.787,2.48
C1206 = smd 1.6 x 1.8: 1 -1.4,0; 2 1.4,0
C0603 = smd 1.1 x 1: 1 -0.85,0; 2 0.85,0
0805-NO = smd 1.3 x 1.5: 1 -0.95,0; 2 0.95,0
0603-NO = smd 1.1 x 1: 1 -0.85,0; 2 0.85,0
RESPACK_4X0603 = smd 0.45 x 0.9: 1 -1.3,-0.85; 2 -0.4,-0.85; 3 0.4,-0.85; 4 1.3,-0.85; 5 1.3,0.85; 6 0.4,0.85; 7 -0.4,0.85; 8 -1.3,0.85
SOT96-1 = smd 0.6 x 1.3: 1 -1.905,-2.65; 2 -0.635,-2.65; 3 0.635,-2.65; 4 1.905,-2.65; 5 1.905,2.65; 6 0.635,2.65; 7 -0.635,2.65; 8 -1.905,2.65
JST_S2B-ZR-SM4A-TF(LF)(SN) = smd 0.7 x 2.5: 1 -0.75,2.15; 2 0.75,2.15 | smd 1.1 x 1.9: S1 -2.7,-1.45; S2 2.7,-1.45
CHIPLED_0805_NOOUTLINE = smd 1.2 x 1.2: A 0,-1.05; C 0,1.05
SOT23-3 = smd 0.8 x 0.9: 1 -0.95,-1; 2 0.95,-1; 3 0,1.1
DO-214AB = smd 2.286 x 4.064: 1 -3.683,0; 2 3.683,0
B1,27 = smd 1.27 x 1.27: TP 0,0
0805-NO@1 = smd 1.24 x 1.5: 1 -0.95,0; 2 0.95,0
JST_SM04B-GHS-TB(LF)(SN)- = smd 0.6 x 1.7: 1 -1.875,2.275; 2 -0.625,2.275; 3 0.625,2.275; 4 1.875,2.275 | smd 1 x 2.7: SH1 -3.725,-0.925; SH2 3.725,-0.925
LGA16_3X3MM = smd 0.5 x 0.25: 1 -1.35,1; 2 -1.35,0.5; 3 -1.35,0; 4 -1.35,-0.5; 5 -1.35,-1; 9 1.35,-1; 10 1.35,-0.5; 11 1.35,0; 12 1.35,0.5; 13 1.35,1 | smd 0.25 x 0.5: 6 -0.5,-1.35; 7 0,-1.35; 8 0.5,-1.35; 14 0.5,1.35; 15 0,1.35; 16 -0.5,1.35
XT30PWM = drill 1.7 pad 2.55: 1 -2.5,-5.912; 2 2.5,-5.912 | drill 1 pad 1.5: 3 5.5,4.088; 4 -5.5,4.088
MHCI0603-4R7M-R8 = smd 2.35 x 3.5: P$1 0.6,3.23; P$2 6.6,3.23
LED3535 = smd 1 x 0.85: 1 -1.75,0.875; 2 -1.75,-0.875; 3 1.75,-0.875; 4 1.75,0.875
S3B-PH-SM4_TB = smd 1 x 2.6: 1 3.81,8.28; 2 5.81,8.28; 3 7.81,8.28 | smd 1 x 3: GND 0.826,2.48; GND2 10.794,2.48
CHIPLED_0603 = smd 0.8 x 0.8: A 0,-0.75; C 0,0.75
2X05_1.27MM_SMT = smd 0.65 x 2.6: 1 -2.54,-1.85; 2 -2.54,1.85; 3 -1.27,-1.85; 4 -1.27,1.85; 5 0,-1.85; 6 0,1.85; 7 1.27,-1.85; 8 1.27,1.85; 9 2.54,-1.85; 10 2.54,1.85
R0603 = smd 1 x 1.1: 1 -0.85,0; 2 0.85,0
0603 = smd 1.1 x 1: 1 -0.85,0; 2 0.85,0
RESPACK_4X0603_NO = smd 0.45 x 0.9: 1 -1.3,-0.85; 2 -0.4,-0.85; 3 0.4,-0.85; 4 1.3,-0.85; 5 1.3,0.85; 6 0.4,0.85; 7 -0.4,0.85; 8 -1.3,0.85
BTN_KMR2_4.6X2.8 = smd 0.9 x 0.9: A 2.05,0.8; A' -2.05,0.8; B 2.05,-0.8; B' -2.05,-0.8
SOIC8_150MIL = smd 0.6 x 2.2: 1 -1.905,-2.6; 2 -0.635,-2.6; 3 0.635,-2.6; 4 1.905,-2.6; 5 1.905,2.6; 6 0.635,2.6; 7 -0.635,2.6; 8 -1.905,2.6
SOP254P700X230-4N = smd 1.65 x 0.65: 1 -3.25,1.27; 2 -3.25,-1.27; 3 3.25,-1.27; 4 3.25,1.27
EG1390 = smd 1 x 1.5: O1 -2.5,2.8; O2 -2.5,-2.8; P1 0,2.8; P2 0,-2.8; S1 2.5,2.8; S2 2.5,-2.8 | hole 1: 1.5,0; -1.5,0
BLE_MODULE_RAYTAC_MDBT40 = smd 1.85 x 0.45: 1 -4.825,4; 2 -4.825,3.3; 3 -4.825,-0.9; 4 -4.825,-1.6; 5 -4.825,-2.3; 6 -4.825,-3; 7 -4.825,-3.7; 8 -4.825,-4.4; 9 -4.825,-5.1; 10 -4.825,-5.8; 11 -4.825,-6.5; 12 -4.825,-7.2; 26 4.825,-7.2; 27 4.825,-6.5; 28 4.825,-5.8; 29 4.825,-5.1; 30 4.825,-4.4; 31 4.825,-3.7; 32 4.825,-3; 33 4.825,-2.3; 34 4.825,-1.6; 35 4.825,-0.9; 36 4.825,-0.2; 37 4.825,0.5; 38 4.825,1.2; 39 4.825,1.9; 40 4.825,2.6; 41 4.825,3.3; 42 4.825,4 | smd 0.45 x 1.85: 13 -4.2,-8.825; 14 -3.5,-8.825; 15 -2.8,-8.825; 16 -2.1,-8.825; 17 -1.4,-8.825; 18 -0.7,-8.825; 19 0,-8.825; 20 0.7,-8.825; 21 1.4,-8.825; 22 2.1,-8.825; 23 2.8,-8.825; 24 3.5,-8.825; 25 4.2,-8.825 | hole 0.9: 2.2,4.45
BM03-GHS-TBT = smd 0.6 x 1.7: 1 1.915,5.08; 2 3.165,5.08; 3 4.415,5.08 | smd 1 x 2.8: A 0.065,1.73; B 6.245,1.73
MP1584_V2 = smd 1.6 x 0.61: BST 2.7,1.905; COMP -2.7,-0.635; EN -2.7,0.635; FB -2.7,-1.905; FREQ 2.7,-0.635; GND 2.7,-1.905; SW -2.7,1.905; VIN 2.7,0.635 | smd 2.62 x 3.51: GND_B 0,0
TQFP64 = smd 1.143 x 0.305: 1 -5.7,3.75; 2 -5.7,3.25; 3 -5.7,2.75; 4 -5.7,2.25; 5 -5.7,1.75; 6 -5.7,1.25; 7 -5.7,0.75; 8 -5.7,0.25; 9 -5.7,-0.25; 10 -5.7,-0.75; 11 -5.7,-1.25; 12 -5.7,-1.75; 13 -5.7,-2.25; 14 -5.7,-2.75; 15 -5.7,-3.25; 16 -5.7,-3.75; 33 5.7,-3.75; 34 5.7,-3.25; 35 5.7,-2.75; 36 5.7,-2.25; 37 5.7,-1.75; 38 5.7,-1.25; 39 5.7,-0.75; 40 5.7,-0.25; 41 5.7,0.25; 42 5.7,0.75; 43 5.7,1.25; 44 5.7,1.75; 45 5.7,2.25; 46 5.7,2.75; 47 5.7,3.25; 48 5.7,3.75 | smd 0.305 x 1.143: 17 -3.75,-5.7; 18 -3.25,-5.7; 19 -2.75,-5.7; 20 -2.25,-5.7; 21 -1.75,-5.7; 22 -1.25,-5.7; 23 -0.75,-5.7; 24 -0.25,-5.7; 25 0.25,-5.7; 26 0.75,-5.7; 27 1.25,-5.7; 28 1.75,-5.7; 29 2.25,-5.7; 30 2.75,-5.7; 31 3.25,-5.7; 32 3.75,-5.7; 49 3.75,5.7; 50 3.25,5.7; 51 2.75,5.7; 52 2.25,5.7; 53 1.75,5.7; 54 1.25,5.7; 55 0.75,5.7; 56 0.25,5.7; 57 -0.25,5.7; 58 -0.75,5.7; 59 -1.25,5.7; 60 -1.75,5.7; 61 -2.25,5.7; 62 -2.75,5.7; 63 -3.25,5.7; 64 -3.75,5.7
USB_C_CUSB31-CFM2AX-01-X = smd 0.575 x 1.15: A1B12 -3.2,3.545; A4B9 -2.4,3.545; B1A12 3.2,3.545; B4A9 2.4,3.545 | smd 0.275 x 1.15: A5 -1.25,3.545; A6 -0.25,3.545; A7 0.25,3.545; A8 1.25,3.545; B5 1.75,3.545; B6 0.75,3.545; B7 -0.75,3.545; B8 -1.75,3.545 | drill 0.6 pad 1 long: M1 -4.32,2.97; M2 4.32,2.97; M3 -4.32,-1.21; M4 4.32,-1.21 | hole 0.65: 2.89,2.47; -2.89,2.47
S4B-PH-SM4_TB = smd 1 x 2.6: 1 3.27,7.9; 2 5.27,7.9; 3 7.27,7.9; 4 9.27,7.9 | smd 1 x 3: GND 0.286,2.1; GND2 12.254,2.1
XTAL3215 = smd 1.1 x 1.9: P$1 1.2,0; P$2 -1.2,0
MICROSD = smd 0.7 x 1.5: 1 9,-10.64; 2 7.9,-10.24; 3 6.8,-10.64; 4 5.7,-11.04; 5 4.6,-10.64; 6 3.5,-11.04; 7 2.4,-10.64; 8 1.3,-10.64 | smd 1.8 x 1.4: CD1 2,-0.44; CD2 8,-0.44 | smd 1.4 x 1.9: MT1 0.4,-13.54; MT2 13.6,-14.44
CRYSTAL_2.5X2 = smd 0.9 x 0.75: 1 -0.825,-0.625; 2 0.825,-0.625; 3 0.825,0.625; 4 -0.825,0.625

### Placement (x,y rotation side)
AUX_GPIO1  -137.16,1.27 0 top  (outside the outline)
AUX_GPIO2  -148.59,1.27 0 top  (outside the outline)
C1  41.66,9.02 180 top
C2  30.35,17.65 90 top
C3  26.67,26.8 90 top
C4  27.94,11.43 0 top
C5  113.79,67.82 180 top
C6  122.94,67.56 0 top
C18  -83.82,105.41 0 top  (outside the outline)
C19  -26.67,105.41 0 top  (outside the outline)
C20  -33.02,105.41 0 top  (outside the outline)
C21  -39.37,105.41 0 top  (outside the outline)
C22  -90.17,105.41 0 top  (outside the outline)
C23  -90.17,85.09 0 top  (outside the outline)
C27  -30.48,93.98 0 top  (outside the outline)
C28  -35.56,93.98 0 top  (outside the outline)
CAN_CONVERTER  -46.99,86.36 0 top  (outside the outline)
CANBUS  -83.82,6.35 0 top  (outside the outline)
CANBUS1  -177.8,-39.37 0 top  (outside the outline)
D1  134.49,78.61 270 top
D2  -20.32,105.41 0 top  (outside the outline)
D3  36.7,15.37 90 top
D4  134.49,80.64 270 top
D+1  -91.44,99.06 0 top  (outside the outline)
D-1  -16.51,105.41 0 top  (outside the outline)
FB1  -45.72,105.41 0 top  (outside the outline)
I2C_1  -154.94,-6.35 0 top  (outside the outline)
I2C_2  -166.37,-6.35 0 top  (outside the outline)
I2C_3  -176.53,-6.35 0 top  (outside the outline)
I2C_4  -176.53,-52.07 0 top  (outside the outline)
I2C_5  -176.53,-63.5 0 top  (outside the outline)
I2C_6  -176.53,-74.93 0 top  (outside the outline)
IMU  -179.07,-83.82 0 top  (outside the outline)
J1  -190.5,-135.89 0 top  (outside the outline)
L2  38.1,22.86 0 top
LED2  -52.07,86.36 0 top  (outside the outline)
MAIN_BOARD  -181.61,-31.75 0 top  (outside the outline)
PC1_PLED  -57.15,85.09 0 top  (outside the outline)
POW  -69.85,92.71 0 top  (outside the outline)
PROGRAMMER  -80.01,76.2 0 top  (outside the outline)
R1  -180.34,-96.52 0 top  (outside the outline)
R2  -180.34,-102.87 0 top  (outside the outline)
R3  -180.34,-90.17 0 top  (outside the outline)
R4  24.38,26.8 90 top
R5  31.24,26.8 90 top
R6  28.96,26.8 270 top
R7  21.72,22.48 270 top
R8  19.05,21.59 180 top
R9  129.54,78.61 0 top
R10  129.54,80.64 0 top
R11  -50.8,93.98 0 top  (outside the outline)
R12  -52.07,105.41 0 top  (outside the outline)
R13  -58.42,105.41 0 top  (outside the outline)
R14  117.22,56.01 270 top
R15  -55.88,93.98 0 top  (outside the outline)
R16  -60.96,93.98 0 top  (outside the outline)
R17  -64.77,105.41 0 top  (outside the outline)
R18  -71.12,105.41 0 top  (outside the outline)
R24  -33.02,100.33 0 top  (outside the outline)
R25  -38.1,100.33 0 top  (outside the outline)
R26  -43.18,100.33 0 top  (outside the outline)
R27  -77.47,105.41 0 top  (outside the outline)
REFF1  22.86,12.7 180 top
RELAY1  -102.87,1.27 0 top  (outside the outline)
RELAY2  -114.3,1.27 0 top  (outside the outline)
RELAY3  -125.73,1.27 0 top  (outside the outline)
RESET  -66.04,93.98 0 top  (outside the outline)
SPI_FLASH  -27.94,86.36 0 top  (outside the outline)
SSR1  -55.88,100.33 0 top  (outside the outline)
SSR2  -68.58,100.33 0 top  (outside the outline)
SSR3  -81.28,100.33 0 top  (outside the outline)
SW1  117.22,49.4 180 top
SWITCH  -205.74,-154.94 0 top  (outside the outline)
U1  118.11,78.74 0 top
U$6  -205.74,-143.51 0 top  (outside the outline)
U$10  25.4,18.92 270 top
U$40  -74.93,53.34 0 top  (outside the outline)
USB_C  -17.78,86.36 0 top  (outside the outline)
VISION  -180.34,-20.32 0 top  (outside the outline)
X4  -74.93,93.98 0 top  (outside the outline)
X8  -43.18,21.59 0 top  (outside the outline)
Y2  -46.99,100.33 0 top  (outside the outline)

### Tracks (layer width: path | path; a pad name or v marks a point on that pad's centre or on a via)
3.3V  (via drill 0.38)  (36 unrouted)
  Top 0.305: v16.51,21.59 R8.2
  Top 0.457: U1.14 114.61,67.95 C5.1 | U1.24 121.61,67.94 C6.1
  Bottom 0.305: v16.51,21.59 15.24,21.59 13.97,20.32 13.97,17.78 22.86,8.89 36.83,8.89 39.37,6.35 v43.18,6.35
  pour Top (no thermals): 44.45,30.48 45.72,29.21 45.72,7.62 45.72,6.35 44.45,5.08 43.18,5.08 41.91,6.35 41.91,29.21 43.18,30.48
3V3EN
  Top 0.61: U$10.EN 26.04,23.03 R6.2 R5.1
24V  (via drill 0.38)  (4 unrouted)
  Top 0.305: R5.2 32.04,27.65 v33.02,26.67
  Bottom 0.305: v26.04,14.35 30.86,14.35 33.02,16.51 v33.02,26.67
  pour Top (no thermals): 25.4,16.51 26.67,16.51 26.67,7.62 25.4,6.35 16.51,6.35 15.24,7.62 15.24,8.89 16.51,10.16 17.78,11.43 24.13,11.43 25.4,12.7
!RESET  (4 unrouted)
AMMO1  (1 unrouted)
AMMO2  (1 unrouted)
BACKUP2  (1 unrouted)
BOARD_RX  (1 unrouted)
BOARD_TX  (1 unrouted)
BOOT0  (1 unrouted)
BST1
  Top 0.813: U$10.BST 29.77,16.22 C2.1
CAN_N  (4 unrouted)
CAN_P  (4 unrouted)
CANRX_N  (1 unrouted)
CANTX_P  (1 unrouted)
CC1  (1 unrouted)
CC2  (1 unrouted)
COMP_3V3
  Top 0.813: U$10.COMP 24.77,24.04 C3.1
CONNECTED_LED
  Top 0.305: U1.39 R10.1
D8_NEOPIX  (1 unrouted)
D11  (1 unrouted)
D12  (1 unrouted)
D13  (2 unrouted)
D+  (2 unrouted)
D-  (2 unrouted)
FB_3V3  (1 unrouted)
  Top 0.813: U$10.FB 19.93,21.62 R8.1
FLASH_CS  (2 unrouted)
FLASH_MISO  (1 unrouted)
FLASH_MOSI  (2 unrouted)
FLASH_SCK  (1 unrouted)
FREQ1
  Top 0.813: U$10.FREQ 24.77,13.76 REFF1.1
GND  (75 unrouted)
  pour Top (no thermals): 40.64,7.62 40.64,13.97 39.37,15.24 33.02,15.24 30.48,12.7 29.21,12.7 27.94,11.43 27.94,10.16 31.75,6.35 39.37,6.35
  pour Top (no thermals): 16.26,22.86 21.84,22.86 24.77,25.78 24.77,26.29 24.38,26.67 23.24,26.67 22.86,27.05 22.86,27.94 24.13,29.21 26.67,29.21 28.32,27.56 29.59,27.56 31.11,29.08 31.11,29.84 30.35,30.61 13.72,30.61 12.7,29.59 12.7,13.97 14.48,12.19 21.72,12.19 23.88,14.35 23.88,16.89 24.77,17.78 27.05,17.78 27.69,18.41 27.69,19.81 27.05,20.45 16.26,20.45 15.62,21.08 15.62,22.23
I2C-1_CL  (4 unrouted)
I2C-1_DA  (4 unrouted)
I2C-2_CL  (3 unrouted)
I2C-2_DA  (3 unrouted)
I2C-3_CL  (3 unrouted)
I2C-3_DA  (3 unrouted)
MODE_3V  (1 unrouted)
  Top 0.457: R14.1 117.28,57.02
MODE_LED
  Top 0.305: U1.38 124.53,79.94 125.86,78.61 R9.1
N$1  (via drill 0.25)
  other vias: 44.45,11.43
N$2  (via drill 0.25)
  other vias: 44.45,12.7
N$3
  Top 0.813: C3.2 R4.2
N$4
  Top 0.457: SW1.P2 R14.2
N$5
  Top 0.305: R9.2 D1.A
N$6
  Top 0.305: R10.2 D4.A
N$7  (via drill 0.25)
  other vias: 44.45,13.97
N$8  (via drill 0.25)
  other vias: 44.45,15.24
N$9  (2 unrouted)
N$10  (2 unrouted)
N$11  (2 unrouted)
N$12  (2 unrouted)
N$13  (1 unrouted)
N$14  (via drill 0.25)
  other vias: 44.45,16.51
N$15  (via drill 0.25)
  other vias: 44.45,17.78
N$16  (via drill 0.25)
  other vias: 44.45,19.05
N$17  (via drill 0.25)
  other vias: 44.45,20.32
N$18  (via drill 0.25)
  other vias: 44.45,21.59
N$19  (via drill 0.25)
  other vias: 43.18,21.59
N$20  (3 unrouted)
N$21  (1 unrouted)
N$22  (2 unrouted)
N$23  (1 unrouted)
N$24  (via drill 0.25)
  other vias: 43.18,20.32
N$25  (via drill 0.25)
  other vias: 43.18,19.05
N$26  (via drill 0.25)
  other vias: 43.18,17.78
N$27  (via drill 0.25)
  other vias: 43.18,16.51
N$28  (via drill 0.25)
  other vias: 43.18,15.24
N$29  (via drill 0.25)
  other vias: 43.18,13.97
N$30  (via drill 0.25)
  other vias: 43.18,12.7
N$31  (via drill 0.25)
  other vias: 43.18,11.43
RELAY1  (1 unrouted)
RELAY2  (1 unrouted)
RELAY3  (1 unrouted)
RX_BT  (1 unrouted)
SD_DETECT  (1 unrouted)
SDIO_CLK  (1 unrouted)
SDIO_CMD  (1 unrouted)
SDIO_D0  (1 unrouted)
SDIO_D1  (1 unrouted)
SDIO_D2  (1 unrouted)
SDIO_D3  (2 unrouted)
SHIELD  (11 unrouted)
SW1
  pour Top (no thermals): 39.37,30.48 40.64,29.21 40.64,19.05 39.37,17.78 30.48,17.78 29.21,19.05 26.67,21.59 26.67,22.86 27.94,24.13 34.29,24.13 35.56,25.4 35.56,29.21 36.83,30.48
SWCLK  (1 unrouted)
SWDIO  (1 unrouted)
SWITCH1  (1 unrouted)
SWITCH2  (1 unrouted)
TX_BT  (1 unrouted)
VBUS  (1 unrouted)
VCAP1  (1 unrouted)
VCAP2  (1 unrouted)
VISION_RX  (1 unrouted)
VISION_TX  (1 unrouted)